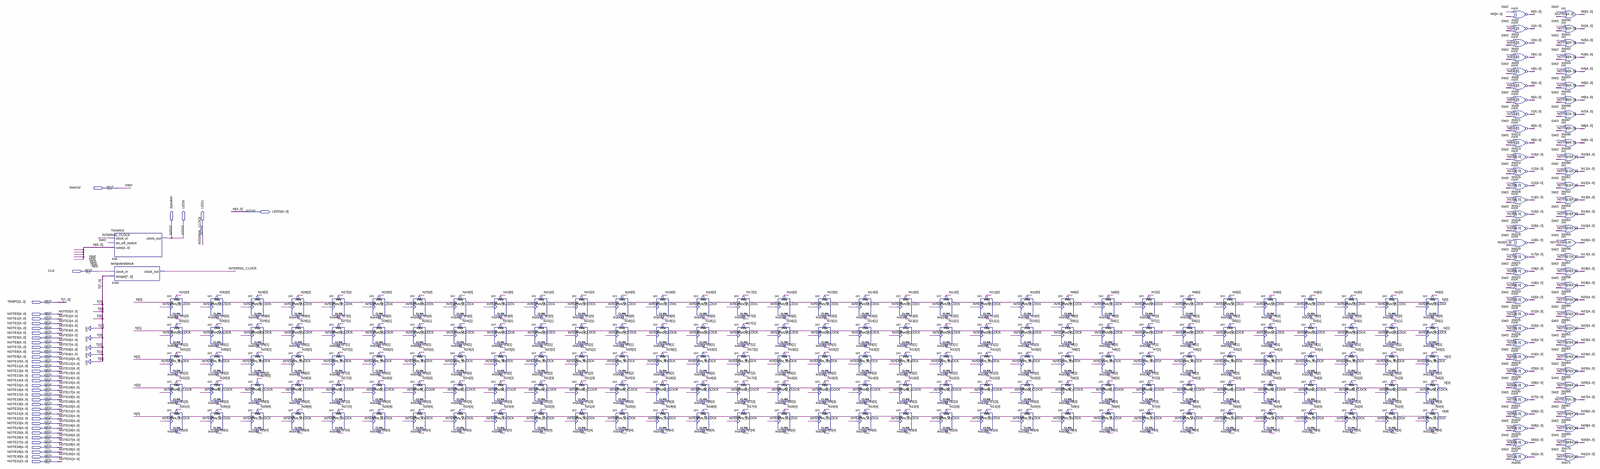
[diagram p0: schematic sheet, whole]
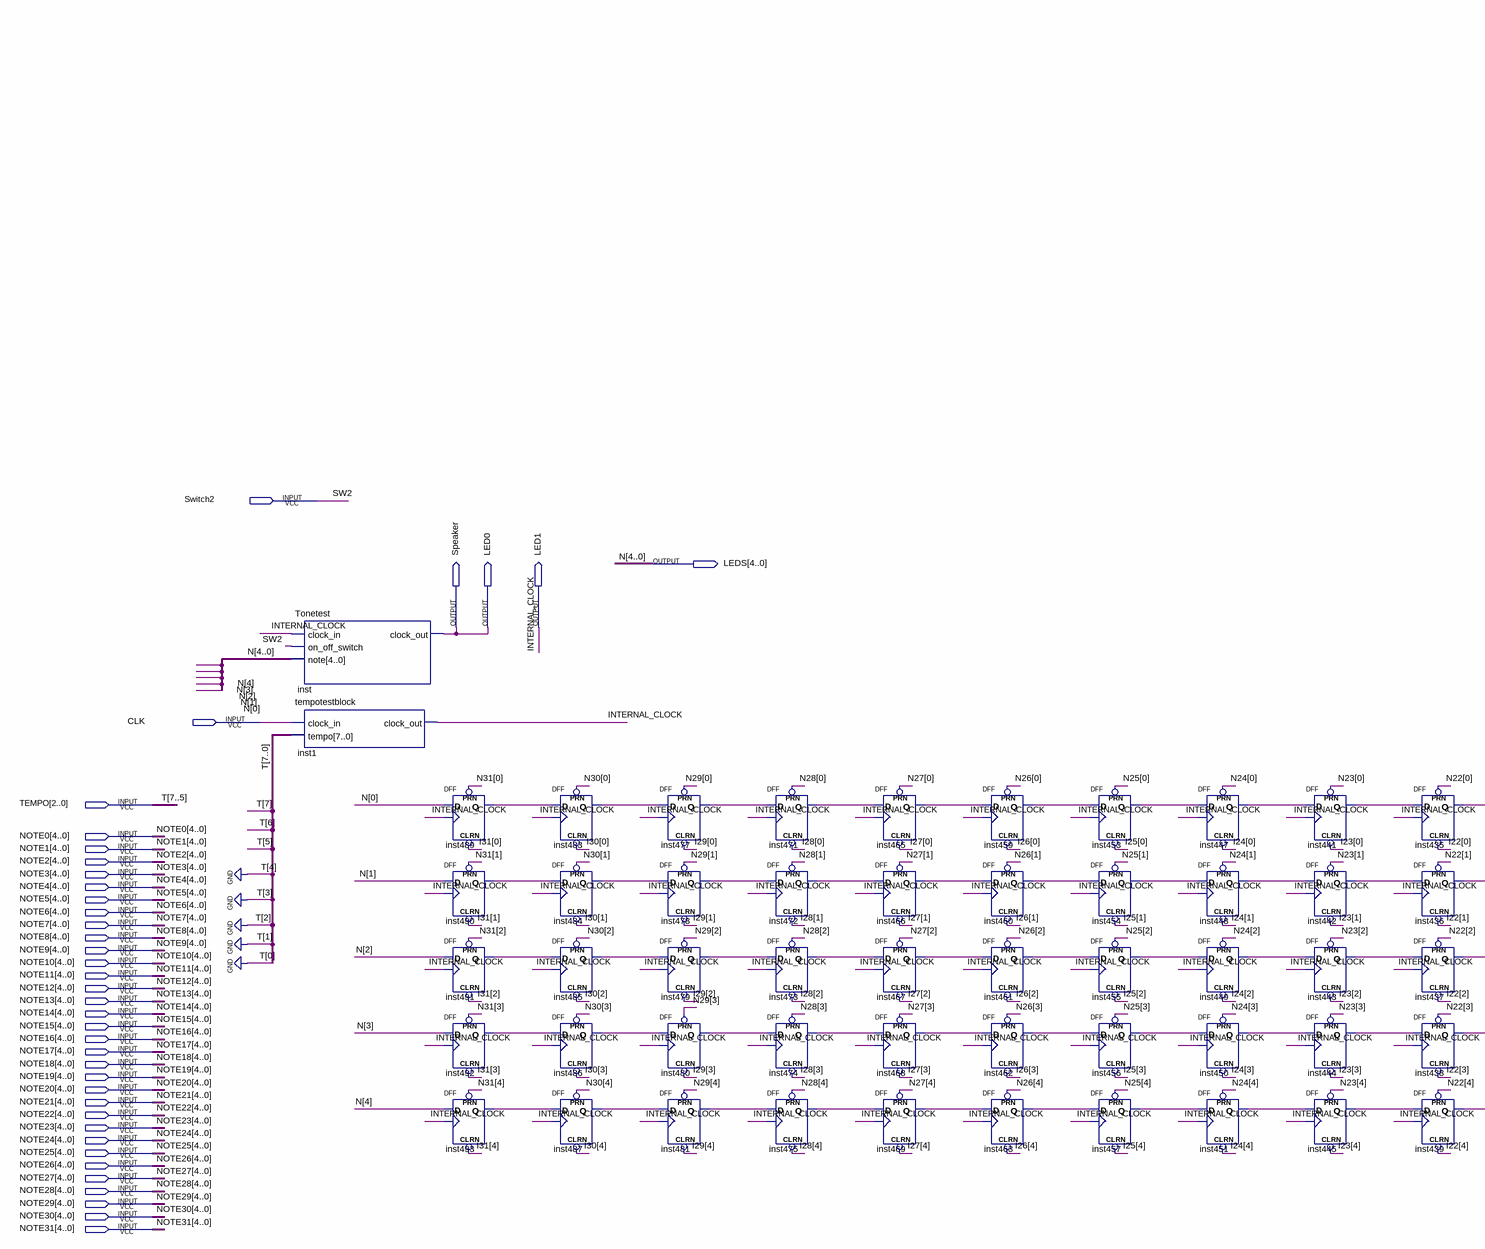
[diagram p1: schematic sheet, left part]
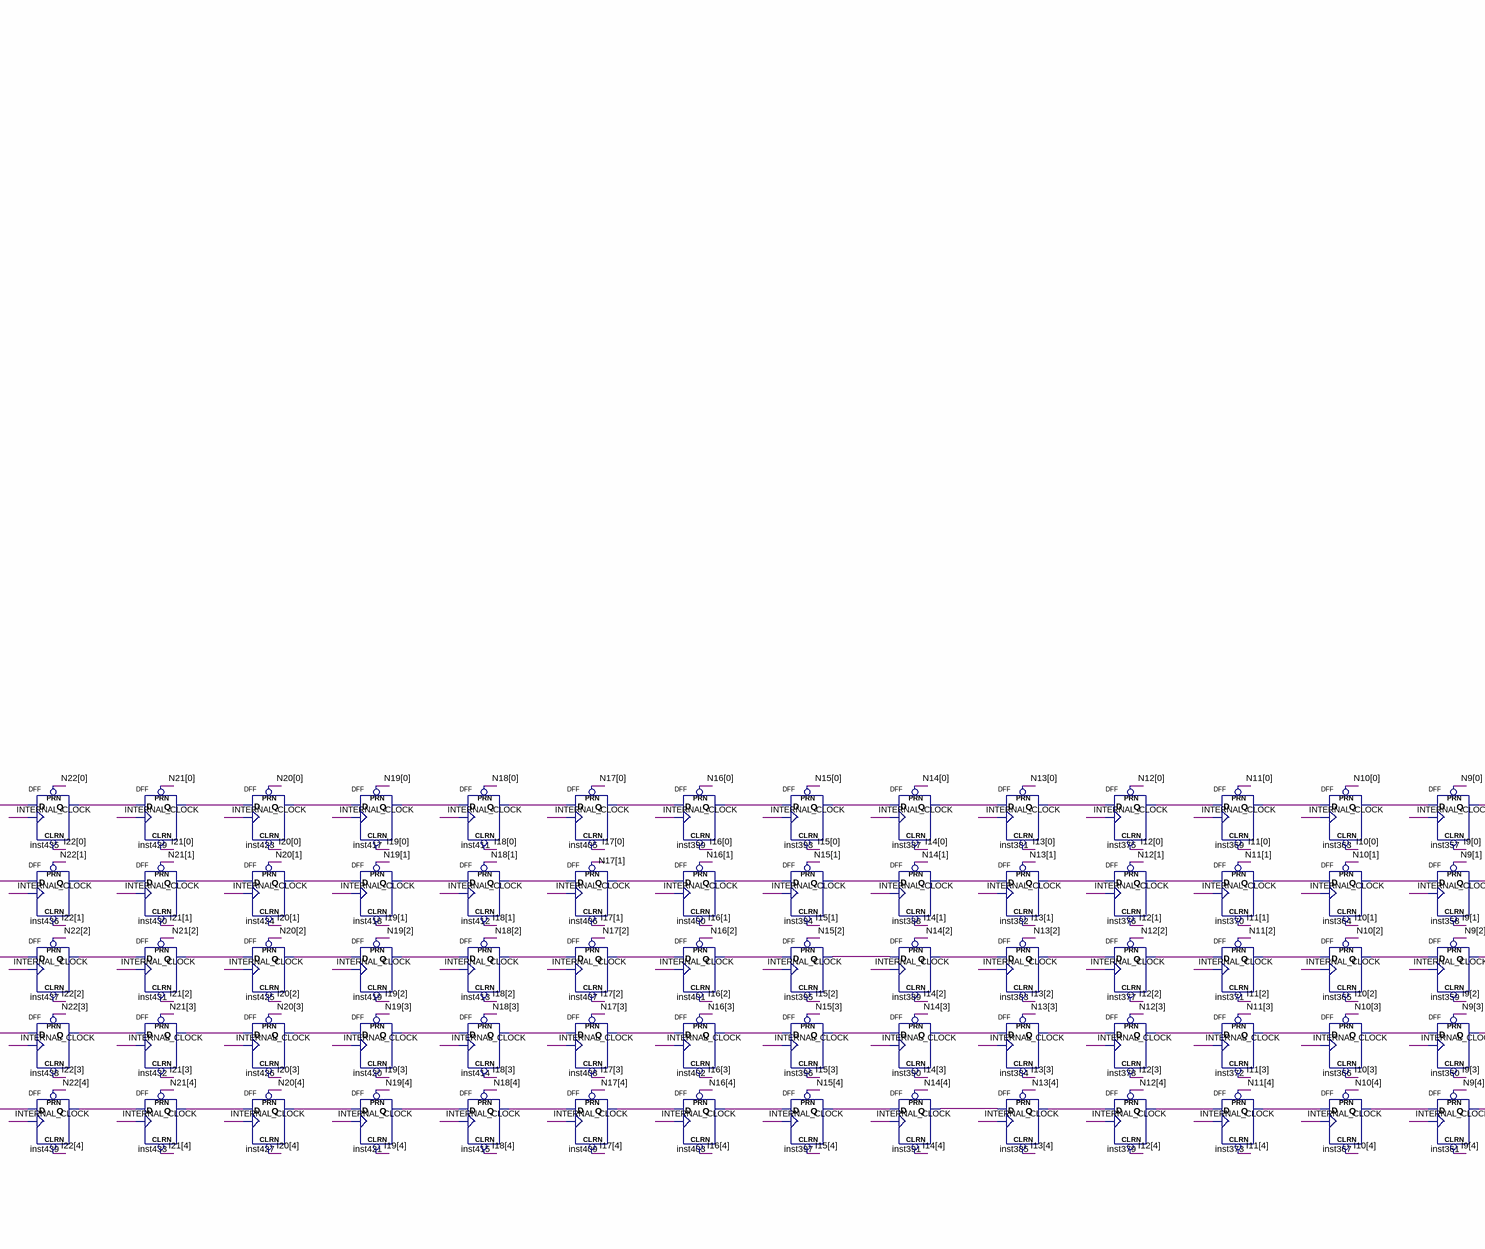
[diagram p2: schematic sheet, centre part]
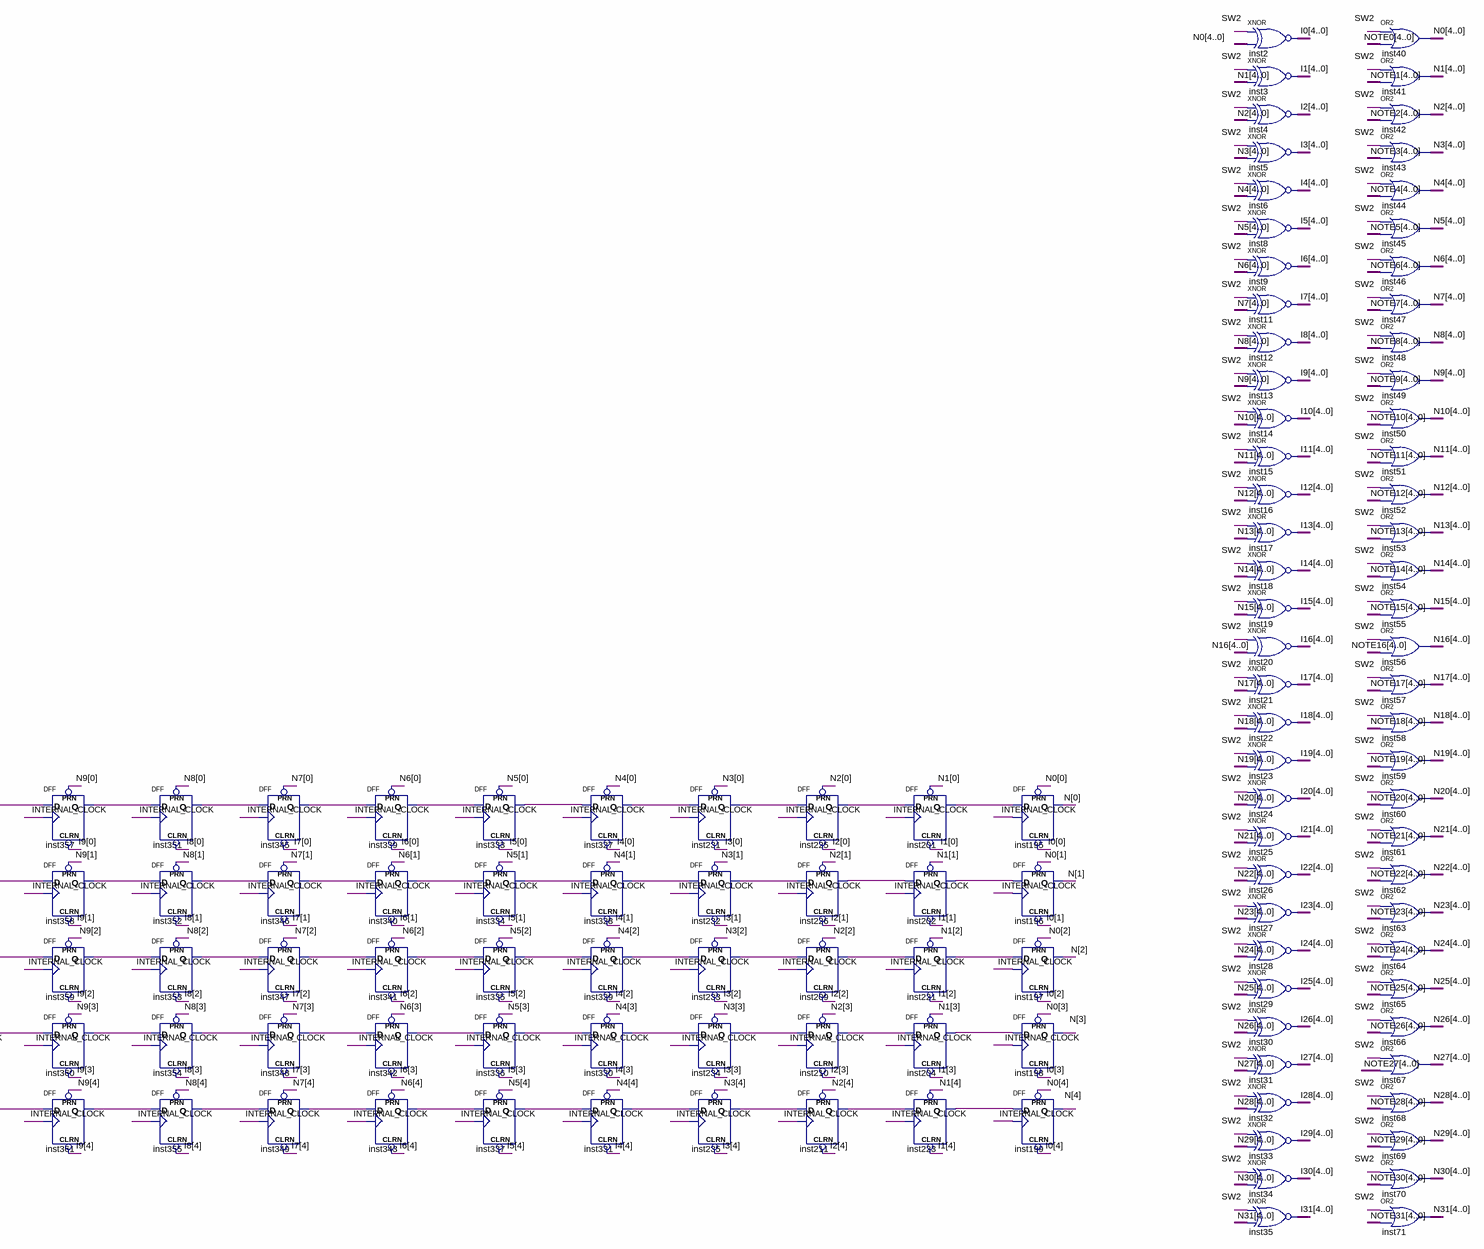
[diagram p3: schematic sheet, right part]
// Quartus schematic sound_regs.bdf as structural Verilog: 226 symbols, 39 pins
module sound_regs (
  input  Switch2,
  input  CLK,
  input  [2:0] TEMPO,
  input  [4:0] NOTE0,
  input  [4:0] NOTE1,
  input  [4:0] NOTE2,
  input  [4:0] NOTE3,
  input  [4:0] NOTE4,
  input  [4:0] NOTE5,
  input  [4:0] NOTE6,
  input  [4:0] NOTE7,
  input  [4:0] NOTE8,
  input  [4:0] NOTE9,
  input  [4:0] NOTE10,
  input  [4:0] NOTE11,
  input  [4:0] NOTE12,
  input  [4:0] NOTE13,
  input  [4:0] NOTE14,
  input  [4:0] NOTE15,
  input  [4:0] NOTE16,
  input  [4:0] NOTE17,
  input  [4:0] NOTE18,
  input  [4:0] NOTE19,
  input  [4:0] NOTE20,
  input  [4:0] NOTE21,
  input  [4:0] NOTE22,
  input  [4:0] NOTE23,
  input  [4:0] NOTE24,
  input  [4:0] NOTE25,
  input  [4:0] NOTE26,
  input  [4:0] NOTE27,
  input  [4:0] NOTE28,
  input  [4:0] NOTE29,
  input  [4:0] NOTE30,
  input  [4:0] NOTE31,
  output [4:0] LEDS,
  output Speaker,
  output LED0,
  output LED1
);

  wire inst201_q, inst202_q, inst204_q, inst209_q, inst210_q, inst211_q, inst221_q, inst223_q, inst225_q,
       inst226_q, inst231_q, inst232_q, inst233_q, inst234_q, inst235_q, inst327_q, inst328_q, inst329_q,
       inst330_q, inst331_q, inst333_q, inst334_q, inst335_q, inst336_q, inst337_q, inst339_q, inst340_q,
       inst341_q, inst342_q, inst343_q, inst345_q, inst346_q, inst347_q, inst348_q, inst349_q, inst351_q,
       inst352_q, inst353_q, inst354_q, inst355_q, inst357_q, inst358_q, inst359_q, inst360_q, inst361_q,
       inst363_q, inst364_q, inst365_q, inst366_q, inst367_q, inst369_q, inst370_q, inst371_q, inst372_q,
       inst373_q, inst375_q, inst376_q, inst377_q, inst378_q, inst379_q, inst381_q, inst382_q, inst383_q,
       inst384_q, inst385_q, inst387_q, inst388_q, inst389_q, inst390_q, inst391_q, inst393_q, inst394_q,
       inst395_q, inst396_q, inst397_q, inst399_q, inst400_q, inst401_q, inst402_q, inst403_q, inst405_q,
       inst406_q, inst407_q, inst408_q, inst409_q, inst411_q, inst412_q, inst413_q, inst414_q, inst415_q,
       inst417_q, inst418_q, inst419_q, inst420_q, inst421_q, inst423_q, inst424_q, inst425_q, inst426_q,
       inst427_q, inst429_q, inst430_q, inst431_q, inst432_q, inst433_q, inst435_q, inst436_q, inst437_q,
       inst438_q, inst439_q, inst441_q, inst442_q, inst443_q, inst444_q, inst445_q, inst447_q, inst448_q,
       inst449_q, inst450_q, inst451_q, inst453_q, inst454_q, inst455_q, inst456_q, inst457_q, inst459_q,
       inst460_q, inst461_q, inst462_q, inst463_q, inst465_q, inst466_q, inst467_q, inst468_q, inst469_q,
       inst471_q, inst472_q, inst473_q, inst474_q, inst475_q, inst477_q, inst478_q, inst479_q, inst480_q,
       inst481_q, inst483_q, inst484_q, inst485_q, inst486_q, inst487_q, inst489_q, inst490_q, inst491_q,
       inst492_q, inst493_q;
  wire [4:0] I0, I1, I2, I3, I4, I5, I6, I7, I8, I9, I10, I11, I12, I13, I14, I15, I16, I17, I18, I19, I20,
       I21, I22, I23, I24, I25, I26, I27, I28, I29, I30, I31, N0, N1, N2, N3, N4, N5, N6, N7, N8, N9, N10,
       N11, N12, N13, N14, N15, N16, N17, N18, N19, N20, N21, N22, N23, N24, N25, N26, N27, N28, N29, N30,
       N31;

  Tonetest inst (.clock_in(LED1), .on_off_switch(Switch2), .note(LEDS), .clock_out(LED0));
  tempotestblock inst1 (.clock_in(CLK), .tempo({TEMPO, {5{1'b0}}}), .clock_out(LED1));
  DFF inst489 (.CLRN(I31[0]), .CLK(LED1), .D(LEDS[0]), .PRN(N31[0]), .Q(inst489_q));
  DFF inst490 (.CLRN(I31[1]), .CLK(LED1), .D(LEDS[1]), .PRN(N31[1]), .Q(inst490_q));
  DFF inst491 (.CLRN(I31[2]), .CLK(LED1), .D(LEDS[2]), .PRN(N31[2]), .Q(inst491_q));
  DFF inst492 (.CLRN(I31[3]), .CLK(LED1), .D(LEDS[3]), .PRN(N31[3]), .Q(inst492_q));
  DFF inst493 (.CLRN(I31[4]), .CLK(LED1), .D(LEDS[4]), .PRN(N31[4]), .Q(inst493_q));
  DFF inst483 (.CLRN(I30[0]), .CLK(LED1), .D(inst489_q), .PRN(N30[0]), .Q(inst483_q));
  DFF inst484 (.CLRN(I30[1]), .CLK(LED1), .D(inst490_q), .PRN(N30[1]), .Q(inst484_q));
  DFF inst485 (.CLRN(I30[2]), .CLK(LED1), .D(inst491_q), .PRN(N30[2]), .Q(inst485_q));
  DFF inst486 (.CLRN(I30[3]), .CLK(LED1), .D(inst492_q), .PRN(N30[3]), .Q(inst486_q));
  DFF inst487 (.CLRN(I30[4]), .CLK(LED1), .D(inst493_q), .PRN(N30[4]), .Q(inst487_q));
  DFF inst477 (.CLRN(I29[0]), .CLK(LED1), .D(inst483_q), .PRN(N29[0]), .Q(inst477_q));
  DFF inst478 (.CLRN(I29[1]), .CLK(LED1), .D(inst484_q), .PRN(N29[1]), .Q(inst478_q));
  DFF inst479 (.CLRN(I29[2]), .CLK(LED1), .D(inst485_q), .PRN(N29[2]), .Q(inst479_q));
  DFF inst480 (.CLRN(I29[3]), .CLK(LED1), .D(inst486_q), .PRN(N29[3]), .Q(inst480_q));
  DFF inst481 (.CLRN(I29[4]), .CLK(LED1), .D(inst487_q), .PRN(N29[4]), .Q(inst481_q));
  DFF inst471 (.CLRN(I28[0]), .CLK(LED1), .D(inst477_q), .PRN(N28[0]), .Q(inst471_q));
  DFF inst472 (.CLRN(I28[1]), .CLK(LED1), .D(inst478_q), .PRN(N28[1]), .Q(inst472_q));
  DFF inst473 (.CLRN(I28[2]), .CLK(LED1), .D(inst479_q), .PRN(N28[2]), .Q(inst473_q));
  DFF inst474 (.CLRN(I28[3]), .CLK(LED1), .D(inst480_q), .PRN(N28[3]), .Q(inst474_q));
  DFF inst475 (.CLRN(I28[4]), .CLK(LED1), .D(inst481_q), .PRN(N28[4]), .Q(inst475_q));
  DFF inst465 (.CLRN(I27[0]), .CLK(LED1), .D(inst471_q), .PRN(N27[0]), .Q(inst465_q));
  DFF inst466 (.CLRN(I27[1]), .CLK(LED1), .D(inst472_q), .PRN(N27[1]), .Q(inst466_q));
  DFF inst467 (.CLRN(I27[2]), .CLK(LED1), .D(inst473_q), .PRN(N27[2]), .Q(inst467_q));
  DFF inst468 (.CLRN(I27[3]), .CLK(LED1), .D(inst474_q), .PRN(N27[3]), .Q(inst468_q));
  DFF inst469 (.CLRN(I27[4]), .CLK(LED1), .D(inst475_q), .PRN(N27[4]), .Q(inst469_q));
  DFF inst459 (.CLRN(I26[0]), .CLK(LED1), .D(inst465_q), .PRN(N26[0]), .Q(inst459_q));
  DFF inst460 (.CLRN(I26[1]), .CLK(LED1), .D(inst466_q), .PRN(N26[1]), .Q(inst460_q));
  DFF inst461 (.CLRN(I26[2]), .CLK(LED1), .D(inst467_q), .PRN(N26[2]), .Q(inst461_q));
  DFF inst462 (.CLRN(I26[3]), .CLK(LED1), .D(inst468_q), .PRN(N26[3]), .Q(inst462_q));
  DFF inst463 (.CLRN(I26[4]), .CLK(LED1), .D(inst469_q), .PRN(N26[4]), .Q(inst463_q));
  DFF inst453 (.CLRN(I25[0]), .CLK(LED1), .D(inst459_q), .PRN(N25[0]), .Q(inst453_q));
  DFF inst454 (.CLRN(I25[1]), .CLK(LED1), .D(inst460_q), .PRN(N25[1]), .Q(inst454_q));
  DFF inst455 (.CLRN(I25[2]), .CLK(LED1), .D(inst461_q), .PRN(N25[2]), .Q(inst455_q));
  DFF inst456 (.CLRN(I25[3]), .CLK(LED1), .D(inst462_q), .PRN(N25[3]), .Q(inst456_q));
  DFF inst457 (.CLRN(I25[4]), .CLK(LED1), .D(inst463_q), .PRN(N25[4]), .Q(inst457_q));
  DFF inst447 (.CLRN(I24[0]), .CLK(LED1), .D(inst453_q), .PRN(N24[0]), .Q(inst447_q));
  DFF inst448 (.CLRN(I24[1]), .CLK(LED1), .D(inst454_q), .PRN(N24[1]), .Q(inst448_q));
  DFF inst449 (.CLRN(I24[2]), .CLK(LED1), .D(inst455_q), .PRN(N24[2]), .Q(inst449_q));
  DFF inst450 (.CLRN(I24[3]), .CLK(LED1), .D(inst456_q), .PRN(N24[3]), .Q(inst450_q));
  DFF inst451 (.CLRN(I24[4]), .CLK(LED1), .D(inst457_q), .PRN(N24[4]), .Q(inst451_q));
  DFF inst441 (.CLRN(I23[0]), .CLK(LED1), .D(inst447_q), .PRN(N23[0]), .Q(inst441_q));
  DFF inst442 (.CLRN(I23[1]), .CLK(LED1), .D(inst448_q), .PRN(N23[1]), .Q(inst442_q));
  DFF inst443 (.CLRN(I23[2]), .CLK(LED1), .D(inst449_q), .PRN(N23[2]), .Q(inst443_q));
  DFF inst444 (.CLRN(I23[3]), .CLK(LED1), .D(inst450_q), .PRN(N23[3]), .Q(inst444_q));
  DFF inst445 (.CLRN(I23[4]), .CLK(LED1), .D(inst451_q), .PRN(N23[4]), .Q(inst445_q));
  DFF inst435 (.CLRN(I22[0]), .CLK(LED1), .D(inst441_q), .PRN(N22[0]), .Q(inst435_q));
  DFF inst436 (.CLRN(I22[1]), .CLK(LED1), .D(inst442_q), .PRN(N22[1]), .Q(inst436_q));
  DFF inst437 (.CLRN(I22[2]), .CLK(LED1), .D(inst443_q), .PRN(N22[2]), .Q(inst437_q));
  DFF inst438 (.CLRN(I22[3]), .CLK(LED1), .D(inst444_q), .PRN(N22[3]), .Q(inst438_q));
  DFF inst439 (.CLRN(I22[4]), .CLK(LED1), .D(inst445_q), .PRN(N22[4]), .Q(inst439_q));
  DFF inst429 (.CLRN(I21[0]), .CLK(LED1), .D(inst435_q), .PRN(N21[0]), .Q(inst429_q));
  DFF inst430 (.CLRN(I21[1]), .CLK(LED1), .D(inst436_q), .PRN(N21[1]), .Q(inst430_q));
  DFF inst431 (.CLRN(I21[2]), .CLK(LED1), .D(inst437_q), .PRN(N21[2]), .Q(inst431_q));
  DFF inst432 (.CLRN(I21[3]), .CLK(LED1), .D(inst438_q), .PRN(N21[3]), .Q(inst432_q));
  DFF inst433 (.CLRN(I21[4]), .CLK(LED1), .D(inst439_q), .PRN(N21[4]), .Q(inst433_q));
  DFF inst423 (.CLRN(I20[0]), .CLK(LED1), .D(inst429_q), .PRN(N20[0]), .Q(inst423_q));
  DFF inst424 (.CLRN(I20[1]), .CLK(LED1), .D(inst430_q), .PRN(N20[1]), .Q(inst424_q));
  DFF inst425 (.CLRN(I20[2]), .CLK(LED1), .D(inst431_q), .PRN(N20[2]), .Q(inst425_q));
  DFF inst426 (.CLRN(I20[3]), .CLK(LED1), .D(inst432_q), .PRN(N20[3]), .Q(inst426_q));
  DFF inst427 (.CLRN(I20[4]), .CLK(LED1), .D(inst433_q), .PRN(N20[4]), .Q(inst427_q));
  DFF inst417 (.CLRN(I19[0]), .CLK(LED1), .D(inst423_q), .PRN(N19[0]), .Q(inst417_q));
  DFF inst418 (.CLRN(I19[1]), .CLK(LED1), .D(inst424_q), .PRN(N19[1]), .Q(inst418_q));
  DFF inst419 (.CLRN(I19[2]), .CLK(LED1), .D(inst425_q), .PRN(N19[2]), .Q(inst419_q));
  DFF inst420 (.CLRN(I19[3]), .CLK(LED1), .D(inst426_q), .PRN(N19[3]), .Q(inst420_q));
  DFF inst421 (.CLRN(I19[4]), .CLK(LED1), .D(inst427_q), .PRN(N19[4]), .Q(inst421_q));
  DFF inst411 (.CLRN(I18[0]), .CLK(LED1), .D(inst417_q), .PRN(N18[0]), .Q(inst411_q));
  DFF inst412 (.CLRN(I18[1]), .CLK(LED1), .D(inst418_q), .PRN(N18[1]), .Q(inst412_q));
  DFF inst413 (.CLRN(I18[2]), .CLK(LED1), .D(inst419_q), .PRN(N18[2]), .Q(inst413_q));
  DFF inst414 (.CLRN(I18[3]), .CLK(LED1), .D(inst420_q), .PRN(N18[3]), .Q(inst414_q));
  DFF inst415 (.CLRN(I18[4]), .CLK(LED1), .D(inst421_q), .PRN(N18[4]), .Q(inst415_q));
  DFF inst405 (.CLRN(I17[0]), .CLK(LED1), .D(inst411_q), .PRN(N17[0]), .Q(inst405_q));
  DFF inst406 (.CLRN(I17[1]), .CLK(LED1), .D(inst412_q), .PRN(N17[1]), .Q(inst406_q));
  DFF inst407 (.CLRN(I17[2]), .CLK(LED1), .D(inst413_q), .PRN(N17[2]), .Q(inst407_q));
  DFF inst408 (.CLRN(I17[3]), .CLK(LED1), .D(inst414_q), .PRN(N17[3]), .Q(inst408_q));
  DFF inst409 (.CLRN(I17[4]), .CLK(LED1), .D(inst415_q), .PRN(N17[4]), .Q(inst409_q));
  DFF inst399 (.CLRN(I16[0]), .CLK(LED1), .D(inst405_q), .PRN(N16[0]), .Q(inst399_q));
  DFF inst400 (.CLRN(I16[1]), .CLK(LED1), .D(inst406_q), .PRN(N16[1]), .Q(inst400_q));
  DFF inst401 (.CLRN(I16[2]), .CLK(LED1), .D(inst407_q), .PRN(N16[2]), .Q(inst401_q));
  DFF inst402 (.CLRN(I16[3]), .CLK(LED1), .D(inst408_q), .PRN(N16[3]), .Q(inst402_q));
  DFF inst403 (.CLRN(I16[4]), .CLK(LED1), .D(inst409_q), .PRN(N16[4]), .Q(inst403_q));
  DFF inst393 (.CLRN(I15[0]), .CLK(LED1), .D(inst399_q), .PRN(N15[0]), .Q(inst393_q));
  DFF inst394 (.CLRN(I15[1]), .CLK(LED1), .D(inst400_q), .PRN(N15[1]), .Q(inst394_q));
  DFF inst395 (.CLRN(I15[2]), .CLK(LED1), .D(inst401_q), .PRN(N15[2]), .Q(inst395_q));
  DFF inst396 (.CLRN(I15[3]), .CLK(LED1), .D(inst402_q), .PRN(N15[3]), .Q(inst396_q));
  DFF inst397 (.CLRN(I15[4]), .CLK(LED1), .D(inst403_q), .PRN(N15[4]), .Q(inst397_q));
  DFF inst387 (.CLRN(I14[0]), .CLK(LED1), .D(inst393_q), .PRN(N14[0]), .Q(inst387_q));
  DFF inst388 (.CLRN(I14[1]), .CLK(LED1), .D(inst394_q), .PRN(N14[1]), .Q(inst388_q));
  DFF inst389 (.CLRN(I14[2]), .CLK(LED1), .D(inst395_q), .PRN(N14[2]), .Q(inst389_q));
  DFF inst390 (.CLRN(I14[3]), .CLK(LED1), .D(inst396_q), .PRN(N14[3]), .Q(inst390_q));
  DFF inst391 (.CLRN(I14[4]), .CLK(LED1), .D(inst397_q), .PRN(N14[4]), .Q(inst391_q));
  DFF inst381 (.CLRN(I13[0]), .CLK(LED1), .D(inst387_q), .PRN(N13[0]), .Q(inst381_q));
  DFF inst382 (.CLRN(I13[1]), .CLK(LED1), .D(inst388_q), .PRN(N13[1]), .Q(inst382_q));
  DFF inst383 (.CLRN(I13[2]), .CLK(LED1), .D(inst389_q), .PRN(N13[2]), .Q(inst383_q));
  DFF inst384 (.CLRN(I13[3]), .CLK(LED1), .D(inst390_q), .PRN(N13[3]), .Q(inst384_q));
  DFF inst385 (.CLRN(I13[4]), .CLK(LED1), .D(inst391_q), .PRN(N13[4]), .Q(inst385_q));
  DFF inst375 (.CLRN(I12[0]), .CLK(LED1), .D(inst381_q), .PRN(N12[0]), .Q(inst375_q));
  DFF inst376 (.CLRN(I12[1]), .CLK(LED1), .D(inst382_q), .PRN(N12[1]), .Q(inst376_q));
  DFF inst377 (.CLRN(I12[2]), .CLK(LED1), .D(inst383_q), .PRN(N12[2]), .Q(inst377_q));
  DFF inst378 (.CLRN(I12[3]), .CLK(LED1), .D(inst384_q), .PRN(N12[3]), .Q(inst378_q));
  DFF inst379 (.CLRN(I12[4]), .CLK(LED1), .D(inst385_q), .PRN(N12[4]), .Q(inst379_q));
  DFF inst369 (.CLRN(I11[0]), .CLK(LED1), .D(inst375_q), .PRN(N11[0]), .Q(inst369_q));
  DFF inst370 (.CLRN(I11[1]), .CLK(LED1), .D(inst376_q), .PRN(N11[1]), .Q(inst370_q));
  DFF inst371 (.CLRN(I11[2]), .CLK(LED1), .D(inst377_q), .PRN(N11[2]), .Q(inst371_q));
  DFF inst372 (.CLRN(I11[3]), .CLK(LED1), .D(inst378_q), .PRN(N11[3]), .Q(inst372_q));
  DFF inst373 (.CLRN(I11[4]), .CLK(LED1), .D(inst379_q), .PRN(N11[4]), .Q(inst373_q));
  DFF inst363 (.CLRN(I10[0]), .CLK(LED1), .D(inst369_q), .PRN(N10[0]), .Q(inst363_q));
  DFF inst364 (.CLRN(I10[1]), .CLK(LED1), .D(inst370_q), .PRN(N10[1]), .Q(inst364_q));
  DFF inst365 (.CLRN(I10[2]), .CLK(LED1), .D(inst371_q), .PRN(N10[2]), .Q(inst365_q));
  DFF inst366 (.CLRN(I10[3]), .CLK(LED1), .D(inst372_q), .PRN(N10[3]), .Q(inst366_q));
  DFF inst367 (.CLRN(I10[4]), .CLK(LED1), .D(inst373_q), .PRN(N10[4]), .Q(inst367_q));
  DFF inst357 (.CLRN(I9[0]), .CLK(LED1), .D(inst363_q), .PRN(N9[0]), .Q(inst357_q));
  DFF inst358 (.CLRN(I9[1]), .CLK(LED1), .D(inst364_q), .PRN(N9[1]), .Q(inst358_q));
  DFF inst359 (.CLRN(I9[2]), .CLK(LED1), .D(inst365_q), .PRN(N9[2]), .Q(inst359_q));
  DFF inst360 (.CLRN(I9[3]), .CLK(LED1), .D(inst366_q), .PRN(N9[3]), .Q(inst360_q));
  DFF inst361 (.CLRN(I9[4]), .CLK(LED1), .D(inst367_q), .PRN(N9[4]), .Q(inst361_q));
  DFF inst351 (.CLRN(I8[0]), .CLK(LED1), .D(inst357_q), .PRN(N8[0]), .Q(inst351_q));
  DFF inst352 (.CLRN(I8[1]), .CLK(LED1), .D(inst358_q), .PRN(N8[1]), .Q(inst352_q));
  DFF inst353 (.CLRN(I8[2]), .CLK(LED1), .D(inst359_q), .PRN(N8[2]), .Q(inst353_q));
  DFF inst354 (.CLRN(I8[3]), .CLK(LED1), .D(inst360_q), .PRN(N8[3]), .Q(inst354_q));
  DFF inst355 (.CLRN(I8[4]), .CLK(LED1), .D(inst361_q), .PRN(N8[4]), .Q(inst355_q));
  DFF inst345 (.CLRN(I7[0]), .CLK(LED1), .D(inst351_q), .PRN(N7[0]), .Q(inst345_q));
  DFF inst346 (.CLRN(I7[1]), .CLK(LED1), .D(inst352_q), .PRN(N7[1]), .Q(inst346_q));
  DFF inst347 (.CLRN(I7[2]), .CLK(LED1), .D(inst353_q), .PRN(N7[2]), .Q(inst347_q));
  DFF inst348 (.CLRN(I7[3]), .CLK(LED1), .D(inst354_q), .PRN(N7[3]), .Q(inst348_q));
  DFF inst349 (.CLRN(I7[4]), .CLK(LED1), .D(inst355_q), .PRN(N7[4]), .Q(inst349_q));
  DFF inst339 (.CLRN(I6[0]), .CLK(LED1), .D(inst345_q), .PRN(N6[0]), .Q(inst339_q));
  DFF inst340 (.CLRN(I6[1]), .CLK(LED1), .D(inst346_q), .PRN(N6[1]), .Q(inst340_q));
  DFF inst341 (.CLRN(I6[2]), .CLK(LED1), .D(inst347_q), .PRN(N6[2]), .Q(inst341_q));
  DFF inst342 (.CLRN(I6[3]), .CLK(LED1), .D(inst348_q), .PRN(N6[3]), .Q(inst342_q));
  DFF inst343 (.CLRN(I6[4]), .CLK(LED1), .D(inst349_q), .PRN(N6[4]), .Q(inst343_q));
  DFF inst333 (.CLRN(I5[0]), .CLK(LED1), .D(inst339_q), .PRN(N5[0]), .Q(inst333_q));
  DFF inst334 (.CLRN(I5[1]), .CLK(LED1), .D(inst340_q), .PRN(N5[1]), .Q(inst334_q));
  DFF inst335 (.CLRN(I5[2]), .CLK(LED1), .D(inst341_q), .PRN(N5[2]), .Q(inst335_q));
  DFF inst336 (.CLRN(I5[3]), .CLK(LED1), .D(inst342_q), .PRN(N5[3]), .Q(inst336_q));
  DFF inst337 (.CLRN(I5[4]), .CLK(LED1), .D(inst343_q), .PRN(N5[4]), .Q(inst337_q));
  DFF inst327 (.CLRN(I4[0]), .CLK(LED1), .D(inst333_q), .PRN(N4[0]), .Q(inst327_q));
  DFF inst328 (.CLRN(I4[1]), .CLK(LED1), .D(inst334_q), .PRN(N4[1]), .Q(inst328_q));
  DFF inst329 (.CLRN(I4[2]), .CLK(LED1), .D(inst335_q), .PRN(N4[2]), .Q(inst329_q));
  DFF inst330 (.CLRN(I4[3]), .CLK(LED1), .D(inst336_q), .PRN(N4[3]), .Q(inst330_q));
  DFF inst331 (.CLRN(I4[4]), .CLK(LED1), .D(inst337_q), .PRN(N4[4]), .Q(inst331_q));
  DFF inst231 (.CLRN(I3[0]), .CLK(LED1), .D(inst327_q), .PRN(N3[0]), .Q(inst231_q));
  DFF inst232 (.CLRN(I3[1]), .CLK(LED1), .D(inst328_q), .PRN(N3[1]), .Q(inst232_q));
  DFF inst233 (.CLRN(I3[2]), .CLK(LED1), .D(inst329_q), .PRN(N3[2]), .Q(inst233_q));
  DFF inst234 (.CLRN(I3[3]), .CLK(LED1), .D(inst330_q), .PRN(N3[3]), .Q(inst234_q));
  DFF inst235 (.CLRN(I3[4]), .CLK(LED1), .D(inst331_q), .PRN(N3[4]), .Q(inst235_q));
  DFF inst225 (.CLRN(I2[0]), .CLK(LED1), .D(inst231_q), .PRN(N2[0]), .Q(inst225_q));
  DFF inst226 (.CLRN(I2[1]), .CLK(LED1), .D(inst232_q), .PRN(N2[1]), .Q(inst226_q));
  DFF inst209 (.CLRN(I2[2]), .CLK(LED1), .D(inst233_q), .PRN(N2[2]), .Q(inst209_q));
  DFF inst210 (.CLRN(I2[3]), .CLK(LED1), .D(inst234_q), .PRN(N2[3]), .Q(inst210_q));
  DFF inst211 (.CLRN(I2[4]), .CLK(LED1), .D(inst235_q), .PRN(N2[4]), .Q(inst211_q));
  DFF inst201 (.CLRN(I1[0]), .CLK(LED1), .D(inst225_q), .PRN(N1[0]), .Q(inst201_q));
  DFF inst202 (.CLRN(I1[1]), .CLK(LED1), .D(inst226_q), .PRN(N1[1]), .Q(inst202_q));
  DFF inst221 (.CLRN(I1[2]), .CLK(LED1), .D(inst209_q), .PRN(N1[2]), .Q(inst221_q));
  DFF inst204 (.CLRN(I1[3]), .CLK(LED1), .D(inst210_q), .PRN(N1[3]), .Q(inst204_q));
  DFF inst223 (.CLRN(I1[4]), .CLK(LED1), .D(inst211_q), .PRN(N1[4]), .Q(inst223_q));
  DFF inst195 (.CLRN(I0[0]), .CLK(LED1), .D(inst201_q), .PRN(N0[0]), .Q(LEDS[0]));
  DFF inst196 (.CLRN(I0[1]), .CLK(LED1), .D(inst202_q), .PRN(N0[1]), .Q(LEDS[1]));
  DFF inst197 (.CLRN(I0[2]), .CLK(LED1), .D(inst221_q), .PRN(N0[2]), .Q(LEDS[2]));
  DFF inst198 (.CLRN(I0[3]), .CLK(LED1), .D(inst204_q), .PRN(N0[3]), .Q(LEDS[3]));
  DFF inst199 (.CLRN(I0[4]), .CLK(LED1), .D(inst223_q), .PRN(N0[4]), .Q(LEDS[4]));
  assign I0 = ~({5{Switch2}} ^ N0);  // XNOR inst2, 5 bits wide
  assign I1 = ~({5{Switch2}} ^ N1);  // XNOR inst3, 5 bits wide
  assign I2 = ~({5{Switch2}} ^ N2);  // XNOR inst4, 5 bits wide
  assign I3 = ~({5{Switch2}} ^ N3);  // XNOR inst5, 5 bits wide
  assign I4 = ~({5{Switch2}} ^ N4);  // XNOR inst6, 5 bits wide
  assign I5 = ~({5{Switch2}} ^ N5);  // XNOR inst8, 5 bits wide
  assign I6 = ~({5{Switch2}} ^ N6);  // XNOR inst9, 5 bits wide
  assign I7 = ~({5{Switch2}} ^ N7);  // XNOR inst11, 5 bits wide
  assign I8 = ~({5{Switch2}} ^ N8);  // XNOR inst12, 5 bits wide
  assign I9 = ~({5{Switch2}} ^ N9);  // XNOR inst13, 5 bits wide
  assign I10 = ~({5{Switch2}} ^ N10);  // XNOR inst14, 5 bits wide
  assign I11 = ~({5{Switch2}} ^ N11);  // XNOR inst15, 5 bits wide
  assign I12 = ~({5{Switch2}} ^ N12);  // XNOR inst16, 5 bits wide
  assign I13 = ~({5{Switch2}} ^ N13);  // XNOR inst17, 5 bits wide
  assign I14 = ~({5{Switch2}} ^ N14);  // XNOR inst18, 5 bits wide
  assign I15 = ~({5{Switch2}} ^ N15);  // XNOR inst19, 5 bits wide
  assign I16 = ~({5{Switch2}} ^ N16);  // XNOR inst20, 5 bits wide
  assign I17 = ~({5{Switch2}} ^ N17);  // XNOR inst21, 5 bits wide
  assign I18 = ~({5{Switch2}} ^ N18);  // XNOR inst22, 5 bits wide
  assign I19 = ~({5{Switch2}} ^ N19);  // XNOR inst23, 5 bits wide
  assign I20 = ~({5{Switch2}} ^ N20);  // XNOR inst24, 5 bits wide
  assign I21 = ~({5{Switch2}} ^ N21);  // XNOR inst25, 5 bits wide
  assign I22 = ~({5{Switch2}} ^ N22);  // XNOR inst26, 5 bits wide
  assign I23 = ~({5{Switch2}} ^ N23);  // XNOR inst27, 5 bits wide
  assign I24 = ~({5{Switch2}} ^ N24);  // XNOR inst28, 5 bits wide
  assign I25 = ~({5{Switch2}} ^ N25);  // XNOR inst29, 5 bits wide
  assign I26 = ~({5{Switch2}} ^ N26);  // XNOR inst30, 5 bits wide
  assign I27 = ~({5{Switch2}} ^ N27);  // XNOR inst31, 5 bits wide
  assign I28 = ~({5{Switch2}} ^ N28);  // XNOR inst32, 5 bits wide
  assign I29 = ~({5{Switch2}} ^ N29);  // XNOR inst33, 5 bits wide
  assign I30 = ~({5{Switch2}} ^ N30);  // XNOR inst34, 5 bits wide
  assign I31 = ~({5{Switch2}} ^ N31);  // XNOR inst35, 5 bits wide
  assign N0 = {5{Switch2}} | NOTE0;  // OR2 inst40, 5 bits wide
  assign N1 = {5{Switch2}} | NOTE1;  // OR2 inst41, 5 bits wide
  assign N2 = {5{Switch2}} | NOTE2;  // OR2 inst42, 5 bits wide
  assign N3 = {5{Switch2}} | NOTE3;  // OR2 inst43, 5 bits wide
  assign N4 = {5{Switch2}} | NOTE4;  // OR2 inst44, 5 bits wide
  assign N5 = {5{Switch2}} | NOTE5;  // OR2 inst45, 5 bits wide
  assign N6 = {5{Switch2}} | NOTE6;  // OR2 inst46, 5 bits wide
  assign N7 = {5{Switch2}} | NOTE7;  // OR2 inst47, 5 bits wide
  assign N8 = {5{Switch2}} | NOTE8;  // OR2 inst48, 5 bits wide
  assign N9 = {5{Switch2}} | NOTE9;  // OR2 inst49, 5 bits wide
  assign N10 = {5{Switch2}} | NOTE10;  // OR2 inst50, 5 bits wide
  assign N11 = {5{Switch2}} | NOTE11;  // OR2 inst51, 5 bits wide
  assign N12 = {5{Switch2}} | NOTE12;  // OR2 inst52, 5 bits wide
  assign N13 = {5{Switch2}} | NOTE13;  // OR2 inst53, 5 bits wide
  assign N14 = {5{Switch2}} | NOTE14;  // OR2 inst54, 5 bits wide
  assign N15 = {5{Switch2}} | NOTE15;  // OR2 inst55, 5 bits wide
  assign N16 = {5{Switch2}} | NOTE16;  // OR2 inst56, 5 bits wide
  assign N17 = {5{Switch2}} | NOTE17;  // OR2 inst57, 5 bits wide
  assign N18 = {5{Switch2}} | NOTE18;  // OR2 inst58, 5 bits wide
  assign N19 = {5{Switch2}} | NOTE19;  // OR2 inst59, 5 bits wide
  assign N20 = {5{Switch2}} | NOTE20;  // OR2 inst60, 5 bits wide
  assign N21 = {5{Switch2}} | NOTE21;  // OR2 inst61, 5 bits wide
  assign N22 = {5{Switch2}} | NOTE22;  // OR2 inst62, 5 bits wide
  assign N23 = {5{Switch2}} | NOTE23;  // OR2 inst63, 5 bits wide
  assign N24 = {5{Switch2}} | NOTE24;  // OR2 inst64, 5 bits wide
  assign N25 = {5{Switch2}} | NOTE25;  // OR2 inst65, 5 bits wide
  assign N26 = {5{Switch2}} | NOTE26;  // OR2 inst66, 5 bits wide
  assign N27 = {5{Switch2}} | NOTE27;  // OR2 inst67, 5 bits wide
  assign N28 = {5{Switch2}} | NOTE28;  // OR2 inst68, 5 bits wide
  assign N29 = {5{Switch2}} | NOTE29;  // OR2 inst69, 5 bits wide
  assign N30 = {5{Switch2}} | NOTE30;  // OR2 inst70, 5 bits wide
  assign N31 = {5{Switch2}} | NOTE31;  // OR2 inst71, 5 bits wide

  assign Speaker = LED0;

  // Other names for the same wires on the sheet: INTERNAL_CLOCK = LED1; N[4:0] = LEDS; SW2 = Switch2; T[7:5] = TEMPO
endmodule
